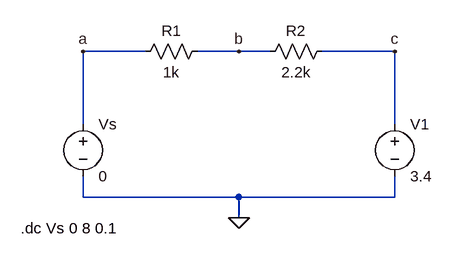
[diagram p0: schematic Lab05Circuit02.asc]
Lab05Circuit02.asc, the LTspice schematic file:
Version 4
SHEET 1 880 680
WIRE 80 80 -16 80
WIRE 224 80 160 80
WIRE 272 80 224 80
WIRE 464 80 352 80
WIRE -16 192 -16 80
WIRE 464 192 464 80
WIRE -16 304 -16 272
WIRE 224 304 -16 304
WIRE 464 304 464 272
WIRE 464 304 224 304
WIRE 224 336 224 304
FLAG 224 336 0
FLAG -16 80 a
FLAG 224 80 b
FLAG 464 80 c
SYMBOL res 368 64 R90
WINDOW 0 0 56 VBottom 2
WINDOW 3 32 56 VTop 2
SYMATTR InstName R2
SYMATTR Value 2.2k
SYMBOL voltage -16 176 R0
WINDOW 123 0 0 Left 0
WINDOW 39 0 0 Left 0
SYMATTR InstName Vs
SYMATTR Value 0
SYMBOL voltage 464 176 R0
WINDOW 123 0 0 Left 0
WINDOW 39 0 0 Left 0
SYMATTR InstName V1
SYMATTR Value 3.4
SYMBOL res 64 96 R270
WINDOW 0 32 56 VTop 2
WINDOW 3 0 56 VBottom 2
SYMATTR InstName R1
SYMATTR Value 1k
TEXT -112 352 Left 2 !.dc Vs 0 8 0.1

The netlist it stands for:
* Lab05Circuit02.asc
R2 c b 2.2k
Vs a 0 0
V1 c 0 3.4
R1 a b 1k
.dc Vs 0 8 0.1
.backanno
.end

* Results of the author's LTspice run, read from the files saved beside the schematic
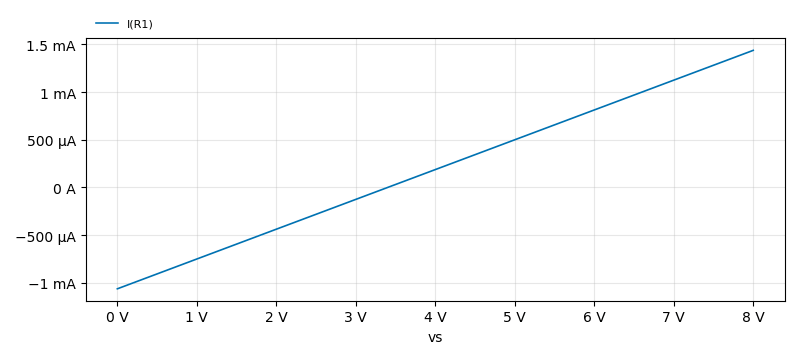
[diagram p1: DC transfer characteristic of Lab05Circuit02.asc, plotted from the saved traces]
* DC transfer characteristic, 1 run:
*   I(R1): -1.063 mA at vs=0 V, 1.438 mA at vs=8 V, min -1.063 mA, max 1.438 mA